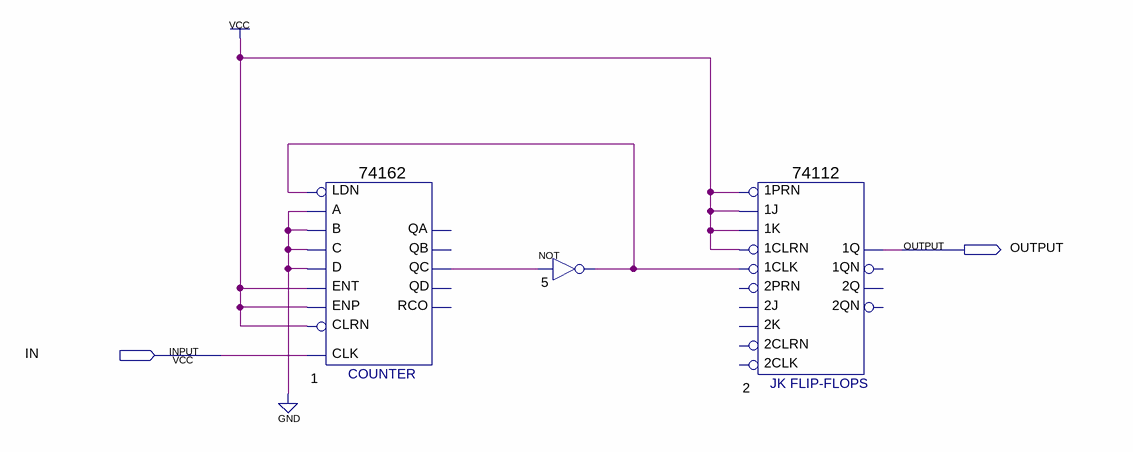
[diagram p0: schematic sheet]
// Quartus schematic 10div.bdf as structural Verilog: 3 symbols, 2 pins
module \10div  (
  input  IN,
  output OUTPUT
);

  wire n1_qc, n5_out;

  \74162  u_1 (
    .A(1'b0), .LDN(n5_out), .B(1'b0), .C(1'b0), .D(1'b0), .ENP(1'b1), .ENT(1'b1), .CLRN(1'b1), .CLK(IN),
    .QC(n1_qc));  // open: QA, QB, QD, RCO
  not u_5 (n5_out, n1_qc);
  \74112  u_2 (
    .\1K (1'b1), .\1J (1'b1), .\1PRN (1'b1), .\1CLK (n5_out), .\1CLRN (1'b1), .\1Q (OUTPUT));  // open: 2K, 2J, 2PRN, 2CLK, 2CLRN, 1QN, 2Q, 2QN
endmodule
